# Altium schematic sheet Sheet2.SchDoc
size B; SheetNumber: 2
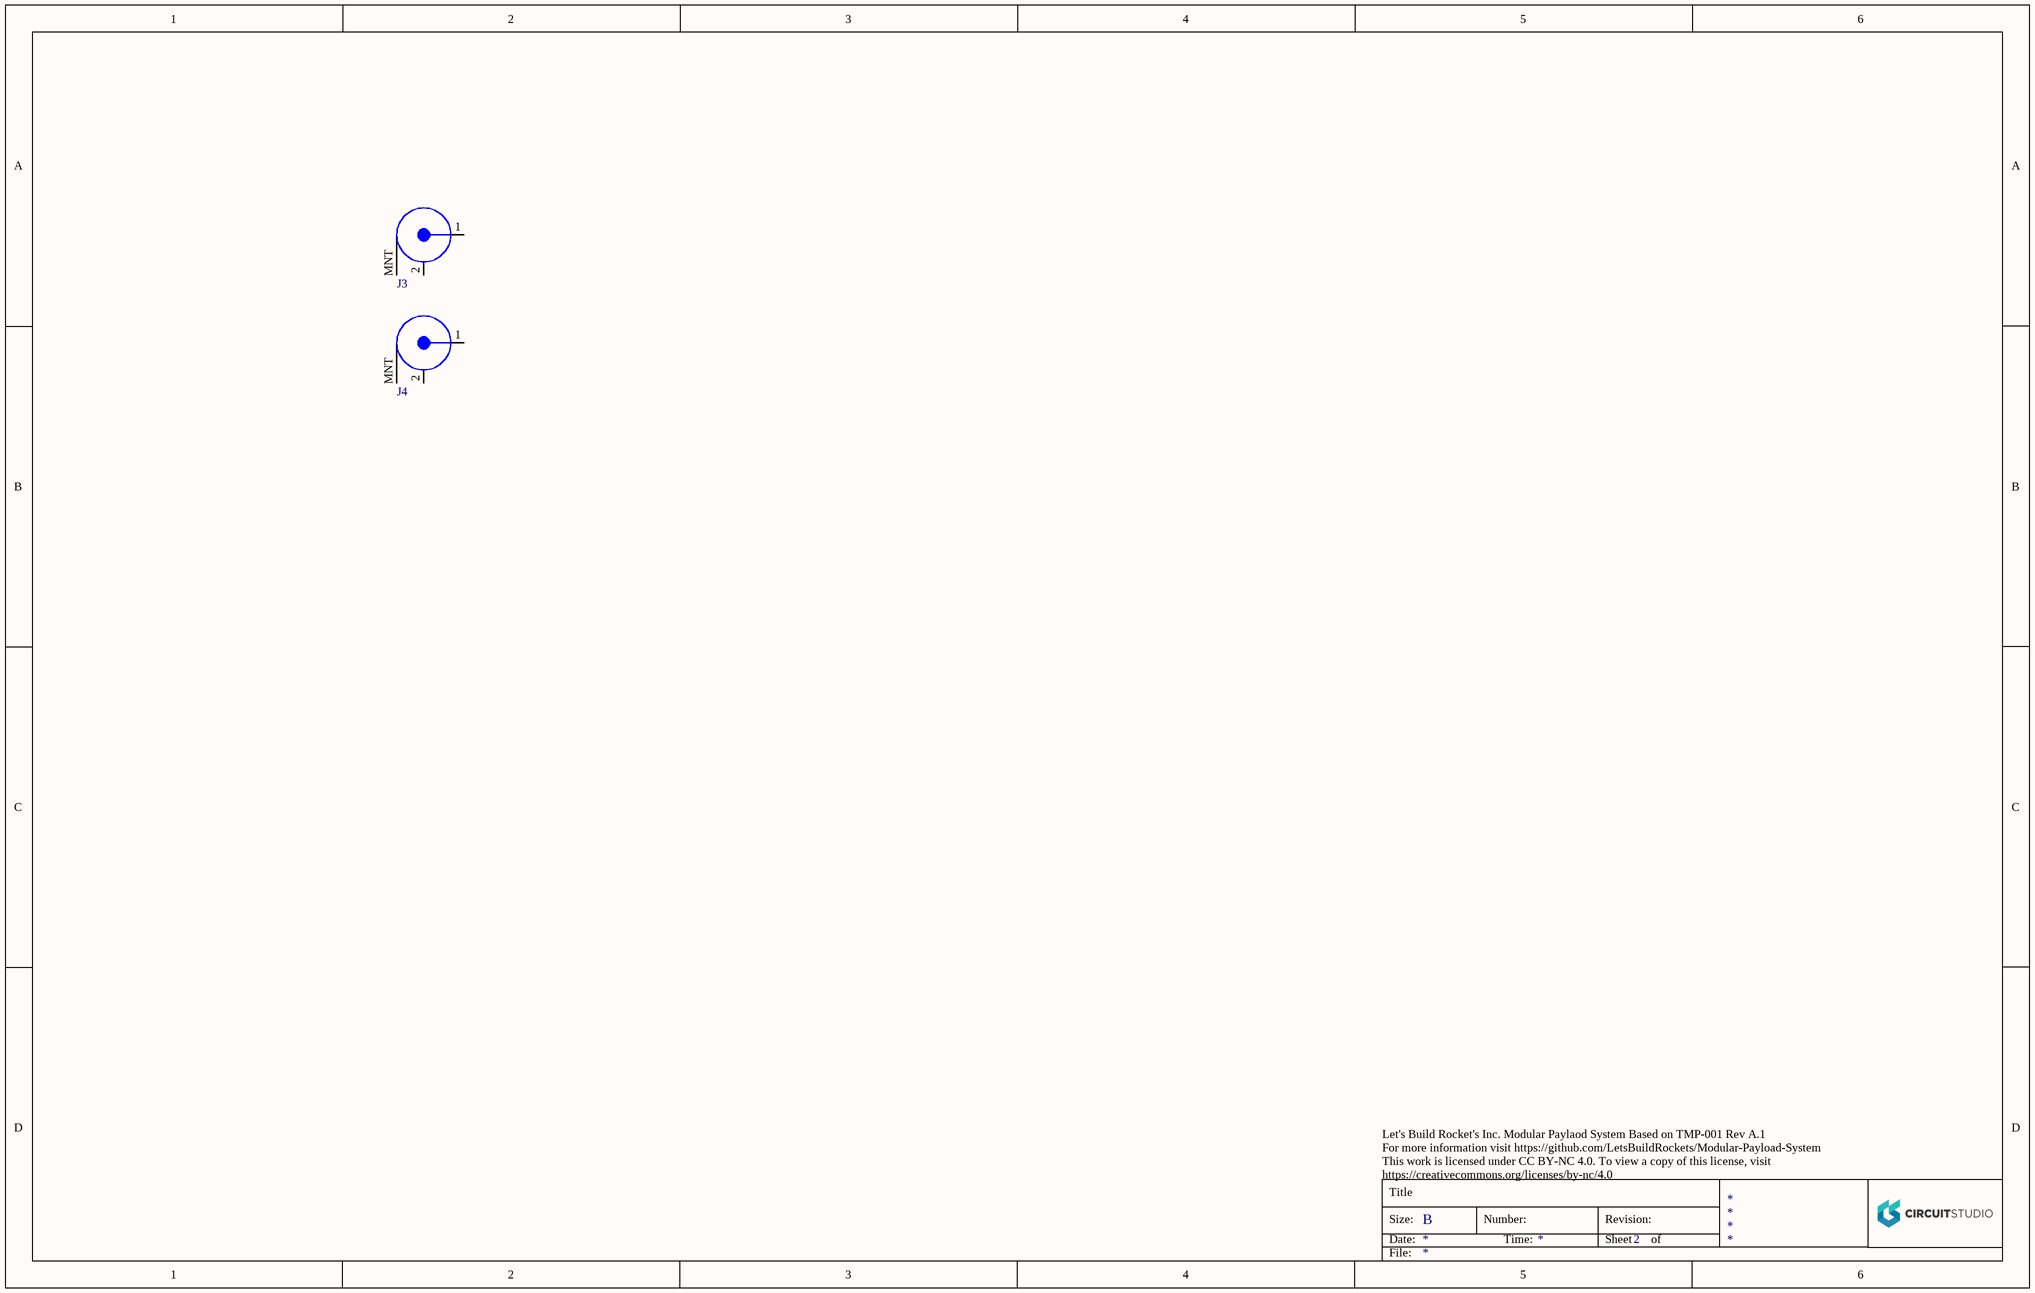
[diagram p0: Sheet2.SchDoc]

## Parts
J3  RF  [BNC R/A]  (value not drawn)
J4  RF  [BNC R/A]  (value not drawn)

## Nets

Not connected (* = marked no-connect by the designer): J3 1 2 MNT; J4 1 2 MNT

## Notes on the sheet
- Let's Build Rocket's Inc. Modular Paylaod System Based on TMP-001 Rev A.1
  For more information visit https://github.com/LetsBuildRockets/Modular-Payload-System
  This work is licensed under CC BY-NC 4.0. To view a copy of this license, visit https://creativecommons.org/licenses/by-nc/4.0
- Title
- Size:
- Date:
- B
- Number:
- Time:
- Revision:
- Sheet
- of
- File: